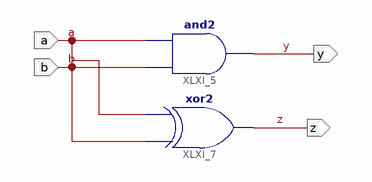
[diagram p0: schematic sheet 1]
// Xilinx ISE schematic elso.sch (spartan3e) as structural Verilog: 2 symbols, 4 ports
module elso (
  input  a,
  input  b,
  output y,
  output z
);

  and XLXI_5 (y, b, a);
  xor XLXI_7 (z, b, a);
endmodule
